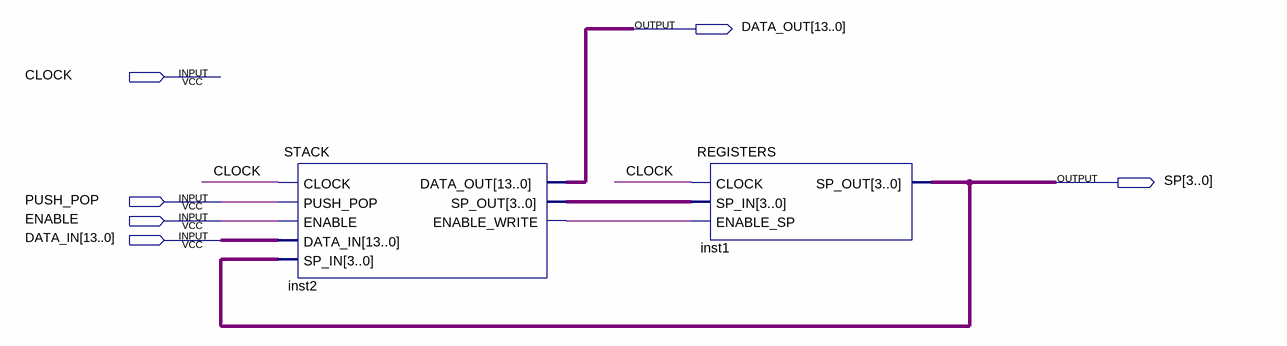
[diagram p0: schematic sheet]
// Quartus schematic TEST.bdf as structural Verilog: 2 symbols, 6 pins
module TEST (
  input  CLOCK,
  input  PUSH_POP,
  input  ENABLE,
  input  [13:0] DATA_IN,
  output [13:0] DATA_OUT,
  output [3:0] SP
);

  wire inst2_enable_write;
  wire [3:0] inst2_sp_out;

  STACK inst2 (
    .CLOCK(CLOCK), .PUSH_POP(PUSH_POP), .ENABLE(ENABLE), .DATA_IN(DATA_IN), .SP_IN(SP), .DATA_OUT(DATA_OUT),
    .SP_OUT(inst2_sp_out), .ENABLE_WRITE(inst2_enable_write));
  REGISTERS inst1 (.CLOCK(CLOCK), .SP_IN(inst2_sp_out), .ENABLE_SP(inst2_enable_write), .SP_OUT(SP));
endmodule
